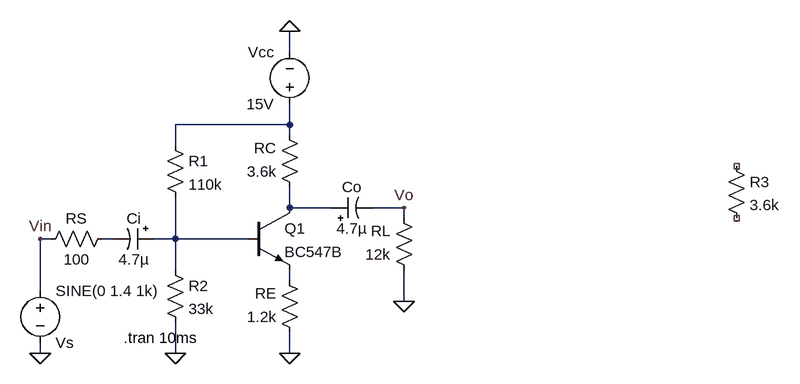
[diagram p0: schematic lab4.1.asc]
lab4.1.asc, the LTspice schematic file:
Version 4
SHEET 1 2268 680
WIRE 288 -112 288 -144
WIRE 288 0 288 -32
WIRE 288 0 112 0
WIRE 288 16 288 0
WIRE 112 32 112 0
WIRE 288 128 288 96
WIRE 352 128 288 128
WIRE 464 128 416 128
WIRE 464 144 464 128
WIRE -80 176 -96 176
WIRE 16 176 0 176
WIRE 112 176 112 112
WIRE 112 176 80 176
WIRE 224 176 112 176
WIRE 112 224 112 176
WIRE 288 240 288 224
WIRE -96 256 -96 176
WIRE 464 272 464 224
WIRE -96 352 -96 336
WIRE 112 352 112 304
WIRE 288 352 288 320
FLAG 288 352 0
FLAG 288 -144 0
FLAG 112 352 0
FLAG -96 352 0
FLAG 464 272 0
FLAG 464 128 Vo
FLAG -96 176 Vin
SYMBOL res 304 112 R180
WINDOW 0 36 76 Left 2
WINDOW 3 36 40 Left 2
SYMATTR InstName RC
SYMATTR Value 3.6k
SYMBOL res 304 336 R180
WINDOW 0 36 76 Left 2
WINDOW 3 36 40 Left 2
SYMATTR InstName RE
SYMATTR Value 1.2k
SYMBOL npn 224 128 R0
SYMATTR InstName Q1
SYMATTR Value BC547B
SYMBOL voltage 288 -16 R180
WINDOW 0 24 96 Left 2
WINDOW 3 24 16 Left 2
WINDOW 123 0 0 Left 0
WINDOW 39 0 0 Left 0
SYMATTR InstName Vcc
SYMATTR Value 15V
SYMBOL res 96 16 R0
SYMATTR InstName R1
SYMATTR Value 110k
SYMBOL res 96 208 R0
SYMATTR InstName R2
SYMATTR Value 33k
SYMBOL res 16 160 R90
WINDOW 0 0 56 VBottom 2
WINDOW 3 32 56 VTop 2
SYMATTR InstName RS
SYMATTR Value 100
SYMBOL res 480 240 R180
WINDOW 0 36 76 Left 2
WINDOW 3 36 40 Left 2
SYMATTR InstName RL
SYMATTR Value 12k
SYMBOL polcap 80 160 R90
WINDOW 0 0 32 VBottom 2
WINDOW 3 32 32 VTop 2
SYMATTR InstName Ci
SYMATTR Value 4.7µ
SYMATTR Description Capacitor
SYMATTR Type cap
SYMATTR SpiceLine V=50 Irms=30m Rser=4.7 Lser=0 mfg="Nichicon" pn="UPR1H4R7MAH" type="Al electrolytic"
SYMBOL voltage -96 240 R0
WINDOW 0 24 96 Left 2
WINDOW 3 24 16 Left 2
WINDOW 123 0 0 Left 0
WINDOW 39 0 0 Left 0
SYMATTR InstName Vs
SYMATTR Value SINE(0 1.4 1k)
SYMBOL polcap 352 144 R270
WINDOW 0 32 32 VTop 2
WINDOW 3 0 32 VBottom 2
SYMATTR InstName Co
SYMATTR Value 4.7µ
SYMATTR Description Capacitor
SYMATTR Type cap
SYMATTR SpiceLine V=50 Irms=30m Rser=4.7 Lser=0 mfg="Nichicon" pn="UPR1H4R7MAH" type="Al electrolytic"
SYMBOL res 960 48 R0
SYMATTR InstName R3
SYMATTR Value 3.6k
TEXT 32 328 Left 2 !.tran 10ms

The netlist it stands for:
* lab4.1.asc
RC N002 N001 3.6k
RE 0 N005 1.2k
Q1 N002 N004 N005 0 BC547B
Vcc N001 0 15V
R1 N001 N004 110k
R2 N004 0 33k
RS N003 Vin 100
RL 0 Vo 12k
Ci N004 N003 4.7µ V=50 Irms=30m Rser=4.7 Lser=0 mfg="Nichicon" pn="UPR1H4R7MAH" type="Al electrolytic"
Vs Vin 0 SINE(0 1.4 1k)
Co N002 Vo 4.7µ V=50 Irms=30m Rser=4.7 Lser=0 mfg="Nichicon" pn="UPR1H4R7MAH" type="Al electrolytic"
R3 NC_01 NC_02 3.6k
.model NPN NPN
.model PNP PNP
.lib standard.bjt
.tran 10ms
.backanno
.end